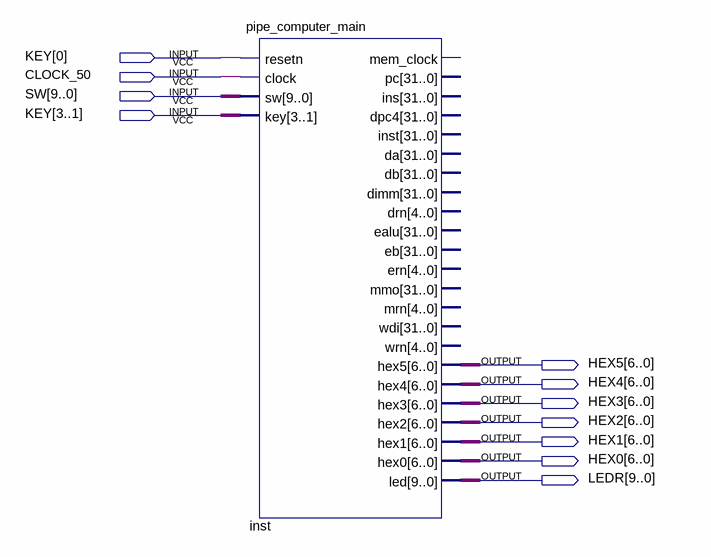
[diagram p0: schematic sheet]
// Quartus schematic pipe_computer.bdf as structural Verilog: 1 symbols, 11 pins
module pipe_computer (
  input  [3:0] KEY,
  input  CLOCK_50,
  input  [9:0] SW,
  output [6:0] HEX5,
  output [6:0] HEX4,
  output [6:0] HEX3,
  output [6:0] HEX2,
  output [6:0] HEX1,
  output [6:0] HEX0,
  output [9:0] LEDR
);

  pipe_computer_main inst (
    .resetn(KEY[0]), .clock(CLOCK_50), .sw(SW), .key(KEY[3:1]), .hex5(HEX5), .hex4(HEX4), .hex3(HEX3),
    .hex2(HEX2), .hex1(HEX1), .hex0(HEX0), .led(LEDR));  // open: mem_clock, pc, ins, dpc4, inst, da, db, dimm, drn, ealu, eb, ern, mmo, mrn, wdi, wrn
endmodule
